# Altium project fingerprint.PrjPcb
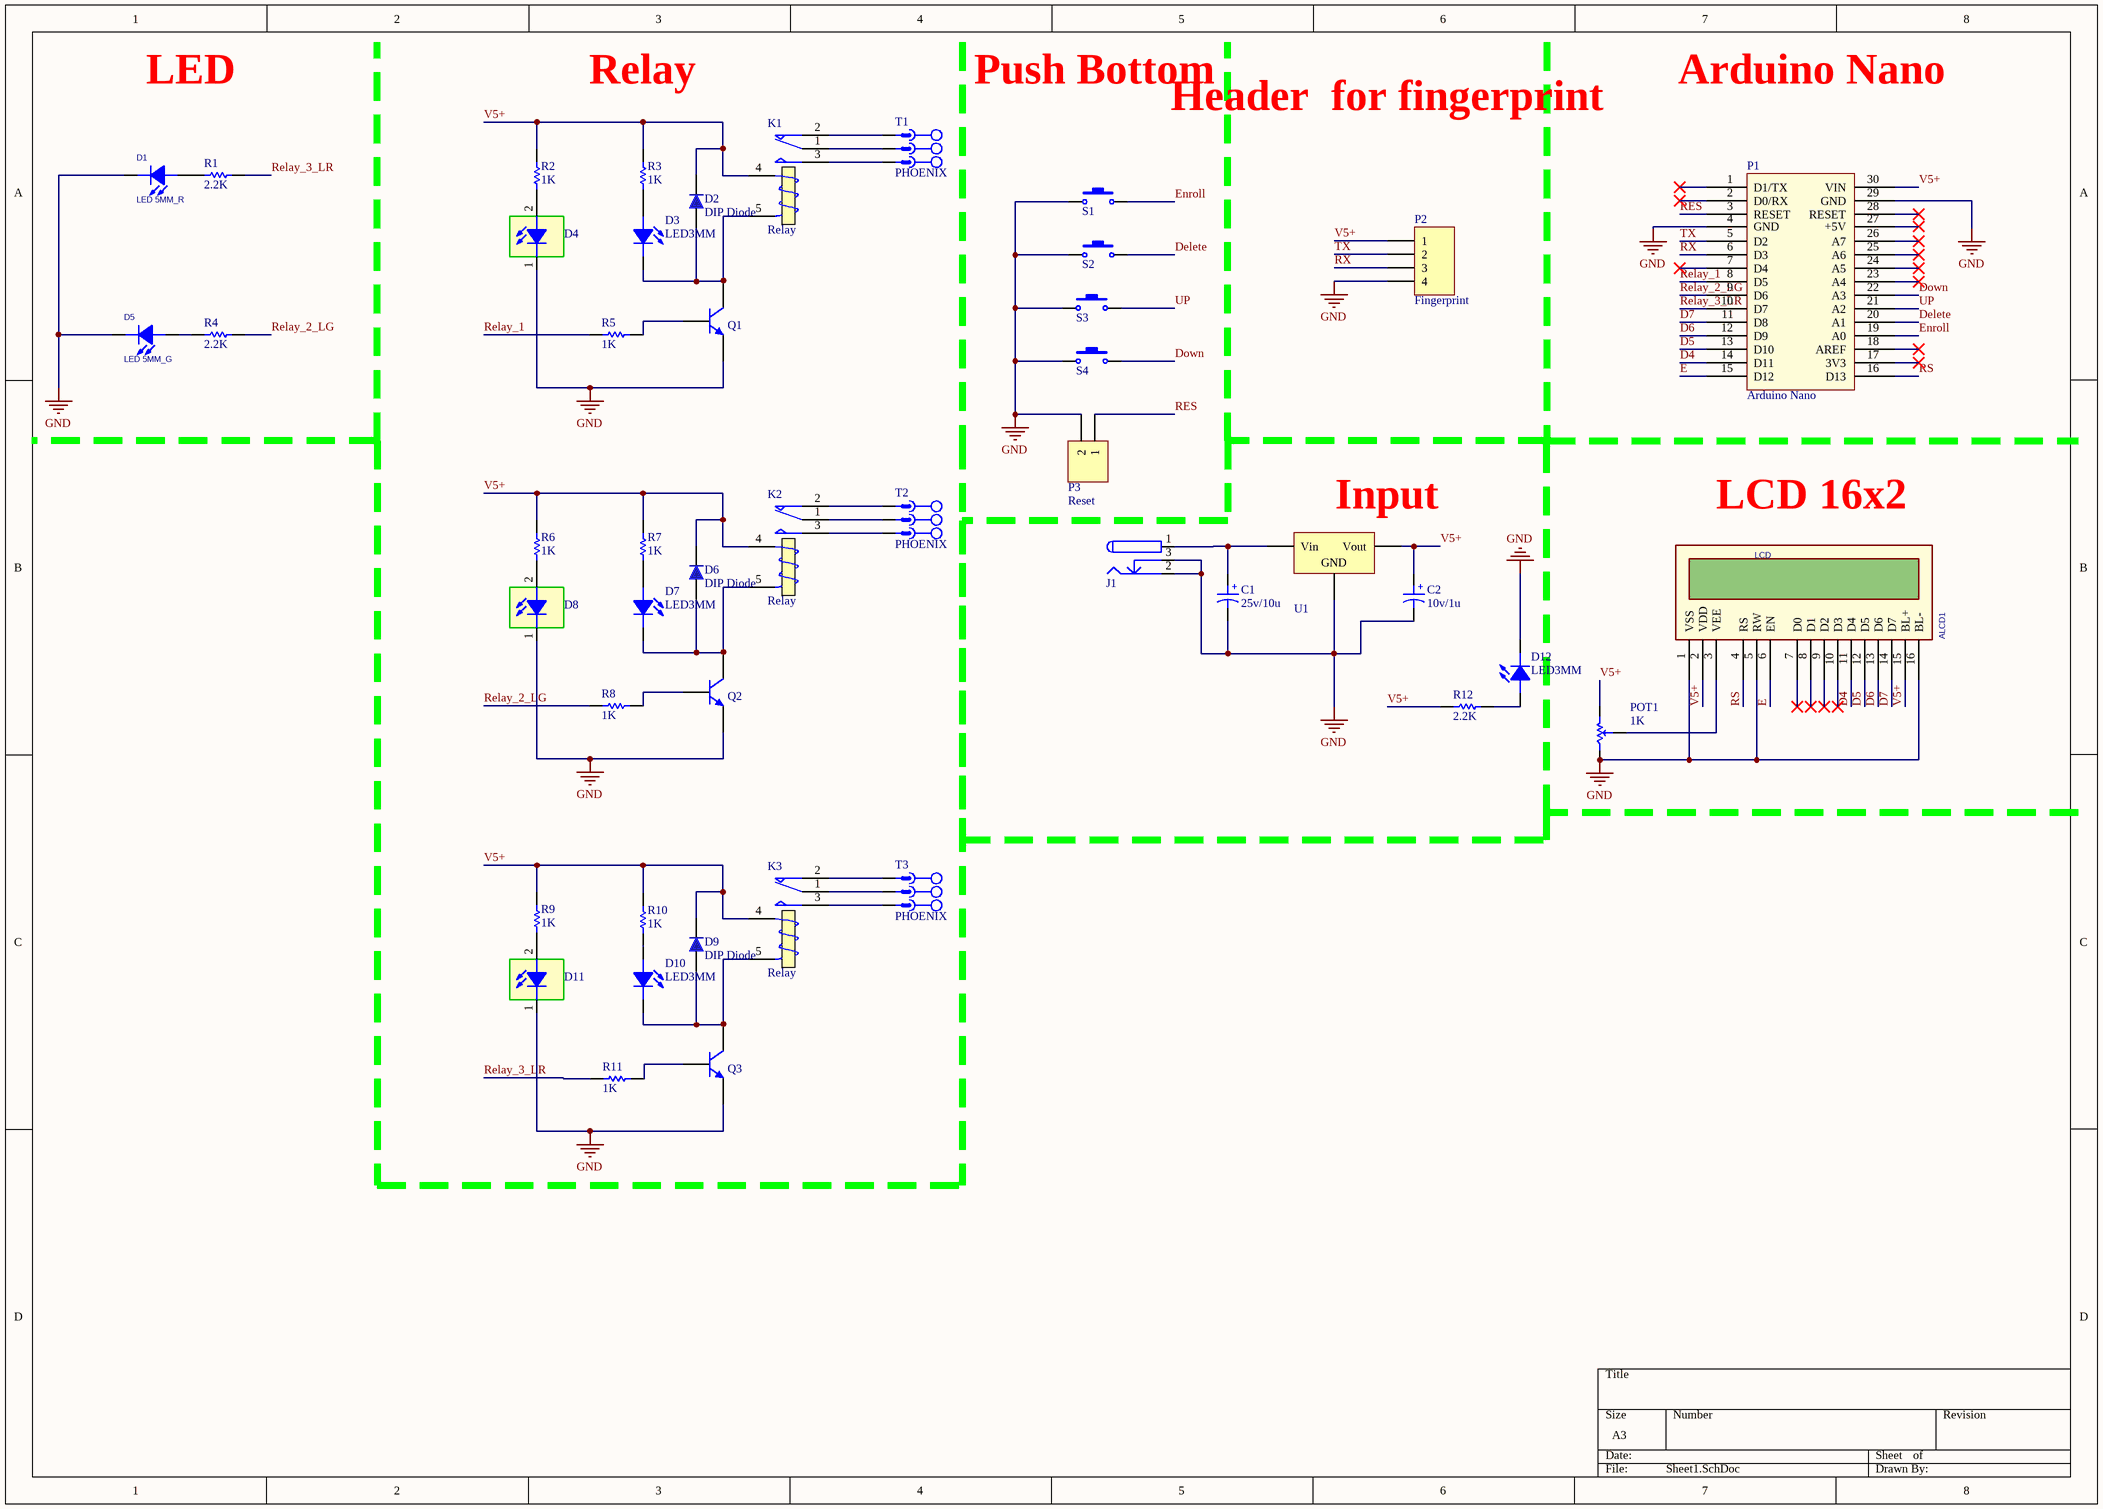
[diagram p0: Sheet1.SchDoc]
1 sheet, 46 parts. Net scope: global (net labels, ports and power ports of the same name join across sheets).
Board file: Fingerprint.PcbDoc

## Sheet Sheet1.SchDoc
size A3; SheetNumber: 1; SheetTotal: 1

### Parts
ALCD1  LCD  [LCD_2X16 BLUE - 2.5mm]
C1  25v/10u  [Cap electrolitic radial 5x11-2]
C2  10v/1u  [Cap electrolitic radial 5x11-2]
D1  LED 5MM_R  [LED5MM_RED]
D2  DIP Diode  [Diode 1n4007]
D3  LED3MM  [LED3mm_GRN]
D4  LED SMD 3528  [LED 3528]  (value not drawn)
D5  LED 5MM_G  [LED5MM_GRN]
D6  DIP Diode  [Diode 1n4007]
D7  LED3MM  [LED3mm_GRN]
D8  LED SMD 3528  [LED 3528]  (value not drawn)
D9  DIP Diode  [Diode 1n4007]
D10  LED3MM  [LED3mm_GRN]
D11  LED SMD 3528  [LED 3528]  (value not drawn)
D12  LED3MM  [LED5MM_RED]
J1  DC Power Jack  [DC Power Jack 1]  (value not drawn)
K1  Relay  [Relay 15.40x12.10x13.10]
K2  Relay  [Relay 15.40x12.10x13.10]
K3  Relay  [Relay 15.40x12.10x13.10]
P1  Arduino Nano  [Arduino Nano]
P2  Fingerprint  [HDR1X4]
P3  Reset  [HDR1X2]
POT1  1K  [POT 1]
Q1  BC547  [TO-92 BENT]  (value not drawn)
Q2  BC547  [TO-92 BENT]  (value not drawn)
Q3  BC547  [TO-92 BENT]  (value not drawn)
R1  2.2K  [Axial 0_25w_2_54mm]
R2  1K  [Axial 0_25w_2_54mm]
R3  1K  [Axial 0_25w_2_54mm]
R4  2.2K  [Axial 0_25w_2_54mm]
R5  1K  [Axial 0_25w_2_54mm]
R6  1K  [Axial 0_25w_2_54mm]
R7  1K  [Axial 0_25w_2_54mm]
R8  1K  [Axial 0_25w_2_54mm]
R9  1K  [Axial 0_25w_2_54mm]
R10  1K  [Axial 0_25w_2_54mm]
R11  1K  [Axial 0_25w_2_54mm]
R12  2.2K  [Axial 0_25w_2_54mm]
S1  Switch PB  [Switch - Push to On]  (value not drawn)
S2  Switch PB  [Switch - Push to On]  (value not drawn)
S3  Switch PB  [Switch - Push to On]  (value not drawn)
S4  Switch PB  [Switch - Push to On]  (value not drawn)
T1  PHOENIX  [MSTBV 2,5/3-G-5]
T2  PHOENIX  [MSTBV 2,5/3-G-5]
T3  PHOENIX  [MSTBV 2,5/3-G-5]
U1  L7805CV  [TO-220 AB with heatsink ya25]  (value not drawn)

### Nets
GND: ALCD1.1(VSS) ALCD1.5(RW) ALCD1.16(BL-) C1.2 C2.2 D1.2(CATHODE) D4.1 D5.2(CATHODE) D8.1 D11.1 D12.2(CATHODE) J1.2 J1.3 P1.4(GND) P1.29(GND) P2.4 P3.2 POT1.1(CCW) Q1.3(E) Q2.3(E) Q3.3(E) S1.1 S2.1 S3.1 S4.1 U1.2(GND)
D4: ALCD1.11(D4) P1.14(D11)
D5: ALCD1.12(D5) P1.13(D10)
D6: ALCD1.13(D6) P1.12(D9)
D7: ALCD1.14(D7) P1.11(D8)
Delete: P1.20(A1) S2.2
Down: P1.22(A3) S4.2
E: ALCD1.6(EN) P1.15(D12)
Enroll: P1.19(A0) S1.2
Relay_1: P1.8(D5) R5.2
Relay_2_LG: P1.9(D6) R4.2 R8.1
Relay_3_LR: P1.10(D7) R1.2 R11.2
RES: P1.3(RESET) P3.1
RS: ALCD1.4(RS) P1.16(D13)
RX: P1.6(D3) P2.3
TX: P1.5(D2) P2.2
UP: P1.21(A2) S3.2
V5+: ALCD1.2(VDD) ALCD1.15(BL+) C2.1 D2.2 D6.2 D9.2 K1.4(T1) K2.4(T1) K3.4(T1) P1.30(VIN) P2.1 POT1.2(CW) R2.2 R3.2 R6.1 R7.1 R9.2 R10.2 R12.1 U1.3(Vout)
NetALCD1_3: ALCD1.3(VEE) POT1.3(SetPoint)
NetC1_1: C1.1 J1.1 U1.1(Vin)
NetD1_1: D1.1(ANODE) R1.1
NetD2_1: D2.1 D3.2(CATHODE) K1.5(T2) Q1.1(C)
NetD3_1: D3.1(ANODE) R3.1
NetD4_2: D4.2 R2.1
NetD5_1: D5.1(ANODE) R4.1
NetD6_1: D6.1 D7.2(CATHODE) K2.5(T2) Q2.1(C)
NetD7_1: D7.1(ANODE) R7.2
NetD8_2: D8.2 R6.2
NetD9_1: D9.1 D10.2(CATHODE) K3.5(T2) Q3.1(C)
NetD10_1: D10.1(ANODE) R10.1
NetD11_2: D11.2 R9.1
NetD12_1: D12.1(ANODE) R12.2
NetK1_1: K1.1(COM) T1.2
NetK1_2: K1.2(NC) T1.1
NetK1_3: K1.3(NO) T1.3
NetK2_1: K2.1(COM) T2.2
NetK2_2: K2.2(NC) T2.1
NetK2_3: K2.3(NO) T2.3
NetK3_1: K3.1(COM) T3.2
NetK3_2: K3.2(NC) T3.1
NetK3_3: K3.3(NO) T3.3
NetQ1_2: Q1.2(B) R5.1
NetQ2_2: Q2.2(B) R8.2
NetQ3_2: Q3.2(B) R11.1

Not connected (* = marked no-connect by the designer): ALCD1 7(D0)* 8(D1)* 9(D2)* 10(D3)*; P1 1(D1/TX)* 2(D0/RX)* 7(D4)* 17(3V3)* 18(AREF)* 23(A4)* 24(A5)* 25(A6)* 26(A7)* 27(+5V)* 28(RESET)*

### Notes on the sheet
- LED
- Relay
- Push Bottom
- Header
  for fingerprint
- Arduino Nano
- (near U1) Input
- LCD 16x2
- (in symbol Cap ELECTROLITIC TOTAL SIZE) +

### Library data of the parts
ALCD1 = LCD: Alphanumic LCD; Designer: Abbas Basereh; Data: 16-12-2016
C1 C2 = Cap ELECTROLITIC TOTAL SIZE: Cap electrolitic radial; Designer: Abbas Basereh; VALUE: 1uF; Data: 16-12-2016; Part. No: *
D1 D5 = LED 5MM: Light Emitting Diode; Designer: Abbas Basereh; Data: 16-12-2016; Link: *; Part.No: *
D2 D6 D9 = Diode DIP Package: Published: 8-Jun-2000; LatestRevisionDate: 17-Jul-2002; LatestRevisionNote: Re-released for DXP Platform.; DatasheetVersion: 1997; Publisher: Altium Limited; PackageDescription: Diode, Axial; Body 3.8 x 1.9 mm (LxDia. max), Lead Dia. 0.53 mm (max); Code_JEDEC: DO-204-AH; ComponentLink1Description: Manufacturer Link; ComponentLink1URL: http://www.fairchildsemi.com/; ComponentLink2Description: Datasheet; ComponentLink2URL: http://www.fairchildsemi.com/ds/1N%2F1N4148.pdf
D3 D7 D10 D12 = LED 3MM: Light Emitting Diode; Designer: Ali Hafizi
D4 D8 D11 = LED SMD 3528: SMD 3528 LED
J1 = DC Power Jack: DC Power Jack. Center Pin 2.5mm. Diameter: 5.7mm; Designer: Ali Hafizi; Company: Personal; Project Name: Laser; Adding Date: 10/21/2009
K1-K3 = RELAY General: Relay_SPDT POWER NEEDLE; Designer: Ali Hafizi; Company: E.P.I.L; Design_Date: 2011/10/31
P2 = Header 4: Header, 4-Pin; LatestRevisionDate: 17-Jul-2002; LatestRevisionNote: Re-released for DXP Platform.; Publisher: Altium Limited
P3 = Header 2: Header, 2-Pin; LatestRevisionDate: 17-Jul-2002; LatestRevisionNote: Re-released for DXP Platform.; Publisher: Altium Limited
POT1 = POT: Variable Resistor; Value: 1K
Q1-Q3 = BC547: NPN General-purpose Transistor; Designer: Abbas Basereh; Desc.: Plastic Medium-Power. Silicon NPN Transistors; Data: 27-12-2016
R1-R12 = RES Axial 0.25W: Designer: Abbas Basereh; Desc.: RES Axial 0.25W; Data: 4-1-2017
S1-S4 = Switch PB: Push Button Switch
T1-T3 = CON_Phoenix_MSTBV_03: 3 Pitch: 5 mm Color: green Contact surface: Tin Assembly; Manufacturer: PHOENIX CONTACT; Connector type: PCB Terminal Block; designer: ABBAS BASEREH; Max Current: 12 A; Positions: 3; Voltage: 320 V; Category: Connector; ComponentLink1Description: Header, Nominal current: 12 A Rated voltage (III/2): 320 V Number of positions: 3 Pitch: 5 mm Color: green Contact surface: Tin Assembly: Soldering  DESIGNER:ABBAS BASEREH; ComponentLink2Description: Reference; Mounting Technology: Through-Hole; Pin Count: 3; Revision 1: 2017-3-1; Status: Unreleased; PART.NO: PHOENIX
U1 = L7805CV-Linear Voltage Regulator: Linear Voltage Regulator IC Positive FIXED Output 5V 1.5A TO-220AB; Manufacturer: STMicroelectronics; Designer: Abbas Basereh; Link: https://www.aliexpress.com/item/; Link: http://www.tme.eu/en/; Link: http://www.digikey.com/; Part. No: L7805CV